# Altium project 掌控拓展板Ⅰ.PrjPcb
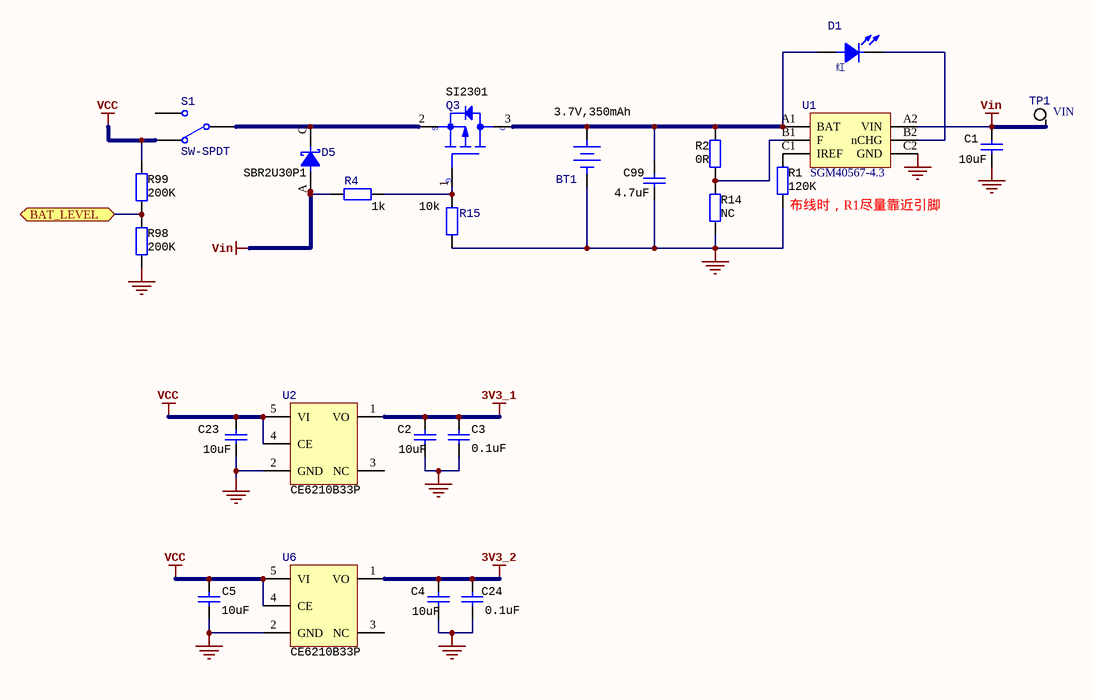
[diagram p0: 1.power.SchDoc]
4 sheets, 124 parts. Net scope: flat (ports and power ports of the same name join across sheets).
Board file: 掌控拓展板Ⅰ V2.1.PcbDoc
Sheets:
  1.power.SchDoc
  2.interface.SchDoc
  3 amplifier.SchDoc
  4.motor.SchDoc

## Sheet 1.power.SchDoc: 接口及电源
size A4; DrawnBy: 蒋朝晖; Organization: Seneasy; DocumentNumber: 项目编号; Revision: V2.1; SheetNumber: 1; SheetTotal: 2; Time: 2020-12-2

### Parts
BT1  3.7V,350mAh  [2P/1.0MM立式贴片座子]
C1  10uF  [C0603]
C2  10uF  [0603]
C3  0.1uF  [0402]
C4  10uF  [0603]
C5  10uF  [0603]
C23  10uF  [0603]
C24  0.1uF  [0402]
C99  4.7uF  [C0603]
D1  红  [0603LED]
D5  SBR2U30P1  [POWERDI123]
Q3  SI2301  [SOT23-3]
R1  120K  [R0402]
R2  0R  [R0402]
R4  1k  [R0402]
R14  NC  [R0402]
R15  10k  [R0402]
R98  200K  [R0402]
R99  200K  [R0402]
S1  SW-SPDT  [SW2]
TP1  VIN  [测试点]
U1  SGM40567-4.3  [SGM40567]
U2  CE6210B33P  [SOT89-5]
U6  CE6210B33P  [SOT89-5]

### Ports
BAT_LEVEL (bidir)

### Nets
3V3_1: C2.1 C3.2 U2.1(VO)
3V3_2: C4.1 C24.2 U6.1(VO)
NetBT1_2: BT1.2(-) C1.2 C2.2 C3.1 C4.2 C5.2 C23.2 C24.1 C99.2 R1.1 R14.2 R15.1 R98.1 U1.C2(GND) U2.2(GND) U6.2(GND)
VCC: C5.1 C23.1 R99.2 S1.3 U2.4(CE) U2.5(VI) U6.4(CE) U6.5(VI)
Vin: C1.1 D5.A(ANODE) R4.2 TP1.1 U1.A2(VIN)
NetBT1_1: BT1.1(+) C99.1 D1.A(ANODE) Q3.3(DRAIN) R2.1 U1.A1(BAT)
NetD1_C: D1.C(CATHODE) U1.B2(nCHG)
NetD5_C: D5.C(CATHODE) Q3.2(SOURCE) S1.2
NetQ3_1: Q3.1(GATE) R4.1 R15.2
NetR1_2: R1.2 U1.C1(IREF)
NetR2_2: R2.2 R14.1 U1.B1(F)
NetR98_2: R98.2 R99.1 ; port BAT_LEVEL

Not connected (* = marked no-connect by the designer): S1 1; U2 3(NC); U6 3(NC)

### Notes on the sheet
- (near R1) 布线时，R1尽量靠近引脚
- 标题:
- Size:
- A4
- 编号:
- 版本:
- 创建:
- 日期:
- Sheet
- of
- 审核:
- (in symbol PMOS) S; D; G

### Library data of the parts
BT1 = Battery: 4.2V Li-lon; Manufacturer: ?; PackageReference: ?; Value: ?; PartNumber: ?; ComponentLink1URL: ?
C1-C5 C23 C24 C99 = CAP1_npol: CAP, CERM, 0.01uF, 100V, +/-5%, X7R, 0603; PartNumber: 06031C103JAT2A; Manufacturer: AVX; Polarized: N; Tolerance: 5; ESR_Ohm: 0.098; Voltage Rating DC: 25V; RoHS Compliant: Y; MountType: SMT; Dielectric: X7R; ComponentLink1URL: http://www.avx.com/docs/masterpubs/smccp.pdf; Operating Temperature: -55+125C; PackageReference: 0603
  C1 C2 C4 C5 C23: Value: 10uF
  C3 C24: Value: 0.1uF
  C99: Value: 4.7uF
D1 = LED1: Manufacturer: ?; PackageReference: ?; PartNumber: ?; Value: ?
D5 = Diode_Schottky: Published: 8-Jun-2000; LatestRevisionDate: 17-Jul-2002; LatestRevisionNote: Re-released for DXP Platform.; PackageReference: SMB; Publisher: Altium Limited; PackageDescription: DO-214-AA/SMB; 2 C-Bend Leads; Body 5.3 x 3.6 mm, inc. leads (LxW); Code_JEDEC: DO-214-AA; Value: ?; PartNumber: ?; Manufacturer: ?
Q3 = PMOS: Manufacturer: ?; PackageReference: ?; PartNumber: ?; Value: ?
R1 R2 R98 R99 = RES1: RES, 1.0k ohm, 5%, 0.1W, 0603; PartNumber: RC0603JR-071KL; Manufacturer: Yageo America; CompType: Resistor; Res_ohm: 1000; Value_Code: 1k00; Tolerance_%: 5; Power_W: 0.1; VDC_V: 50; TempCo: 100 ppm/C; EIA_Code: E24; U/M: EA; SymbolVersion: 2009-05-29; RoHS: Y; Value1: 5%; Value2: 0.1W; MountType: SMT; Technology: Thick Film; Published: 2008-06-26; Publisher: Texas Instruments; LatestRevisionDate: 2014-04-18; ComponentLink1Description: Datasheet link; ComponentLink1URL: http://www.yageo.com/pdf/Pu-RC0603_51_PbFree_L_2.pdf; Supplier Part Number 1: 311-1.0KGRCT-ND; Supplier 2: Mouser; Supplier Part Number 2: 603-RC0603JR-071KL; Supplier 3: Farnell; Supplier Part Number 3: 9233385; PackageReference: 0603
  R1: Value: 120K
  R2: Value: 0R
  R98 R99: Value: 200K
R4 = Res2: Resistor; Published: 8-Jun-2000; LatestRevisionDate: 17-Jul-2002; LatestRevisionNote: Re-released for DXP Platform.; PackageReference: AXIAL-0.4; Publisher: Altium Limited; PackageDescription: Axial Device, Thru-Hole; 2 Leads; 0.4 in Pin Spacing; Value: 1K
R14 = RES1: RES, 1.0k ohm, 5%, 0.1W, 0603; PartNumber: RC0603JR-071KL; Manufacturer: Yageo America; CompType: Resistor; Res_ohm: 1000; Value_Code: 1k00; Tolerance_%: 5; Power_W: 0.1; VDC_V: 50; TempCo: 100 ppm/C; EIA_Code: E24; U/M: EA; Value: 0R; SymbolVersion: 2009-05-29; RoHS: Y; Value1: 5%; Value2: 0.1W; MountType: SMT; Technology: Thick Film; Published: 2008-06-26; Publisher: Texas Instruments; LatestRevisionDate: 2014-04-18; ComponentLink1Description: Datasheet link; ComponentLink1URL: http://www.yageo.com/pdf/Pu-RC0603_51_PbFree_L_2.pdf; Supplier Part Number 1: 311-1.0KGRCT-ND; Supplier 2: Mouser; Supplier Part Number 2: 603-RC0603JR-071KL; Supplier 3: Farnell; Supplier Part Number 3: 9233385; PackageReference: 0603
R15 = Res2: Resistor; Value: 1K; Published: 8-Jun-2000; LatestRevisionDate: 17-Jul-2002; LatestRevisionNote: Re-released for DXP Platform.; PackageReference: AXIAL-0.4; Publisher: Altium Limited; PackageDescription: Axial Device, Thru-Hole; 2 Leads; 0.4 in Pin Spacing
S1 = SW-SPDT: SPDT Subminiature Toggle Switch, Right Angle Mounting, Vertical Actuation; Published: 24-Mar-1999; LatestRevisionDate: 17-Dec-2003; LatestRevisionNote: Schematic revised, PCB Footprint replaced.; DatasheetVersion: 05-Dec-2000; PackageReference: TL36WW15050; Publisher: Altium Limited; PackageDescription: Switch; 4 Leads; ComponentLink1Description: Manufacturer Link; ComponentLink1URL: http://www.apem.com; 采购网址: http://www.cnhsdz.com/huansheng/products_content-437702.html
TP1 = TP: Test Point
U1 = SGM40567: 充电IC
U2 U6 = AP2112K

## Sheet 2.interface.SchDoc: 接口
size A4; DrawnBy: 蒋朝晖; Organization: Seneasy; DocumentNumber: 项目编号; Revision: V2.1; SheetNumber: 1; SheetTotal: 2; PageSetup: Record=PageOptions|CenterHorizontal=True|CenterVertical=True|PrintScale=0.98|XCorrection=1.00|YCorrection=1.00|PrintKind=1|BorderSize=5000000|LeftOffset=0|BottomOffset=0|Orientation=2|PaperLength=2970|PaperWidth=2100|Scale=100|PaperSource=261|PrintQuality=-3|MediaType=1|DitherType=10|PrintScaleMode=1|PaperKind=A4 210 x 297 毫米¦PaperIndex=9; Time: 2020-12-2
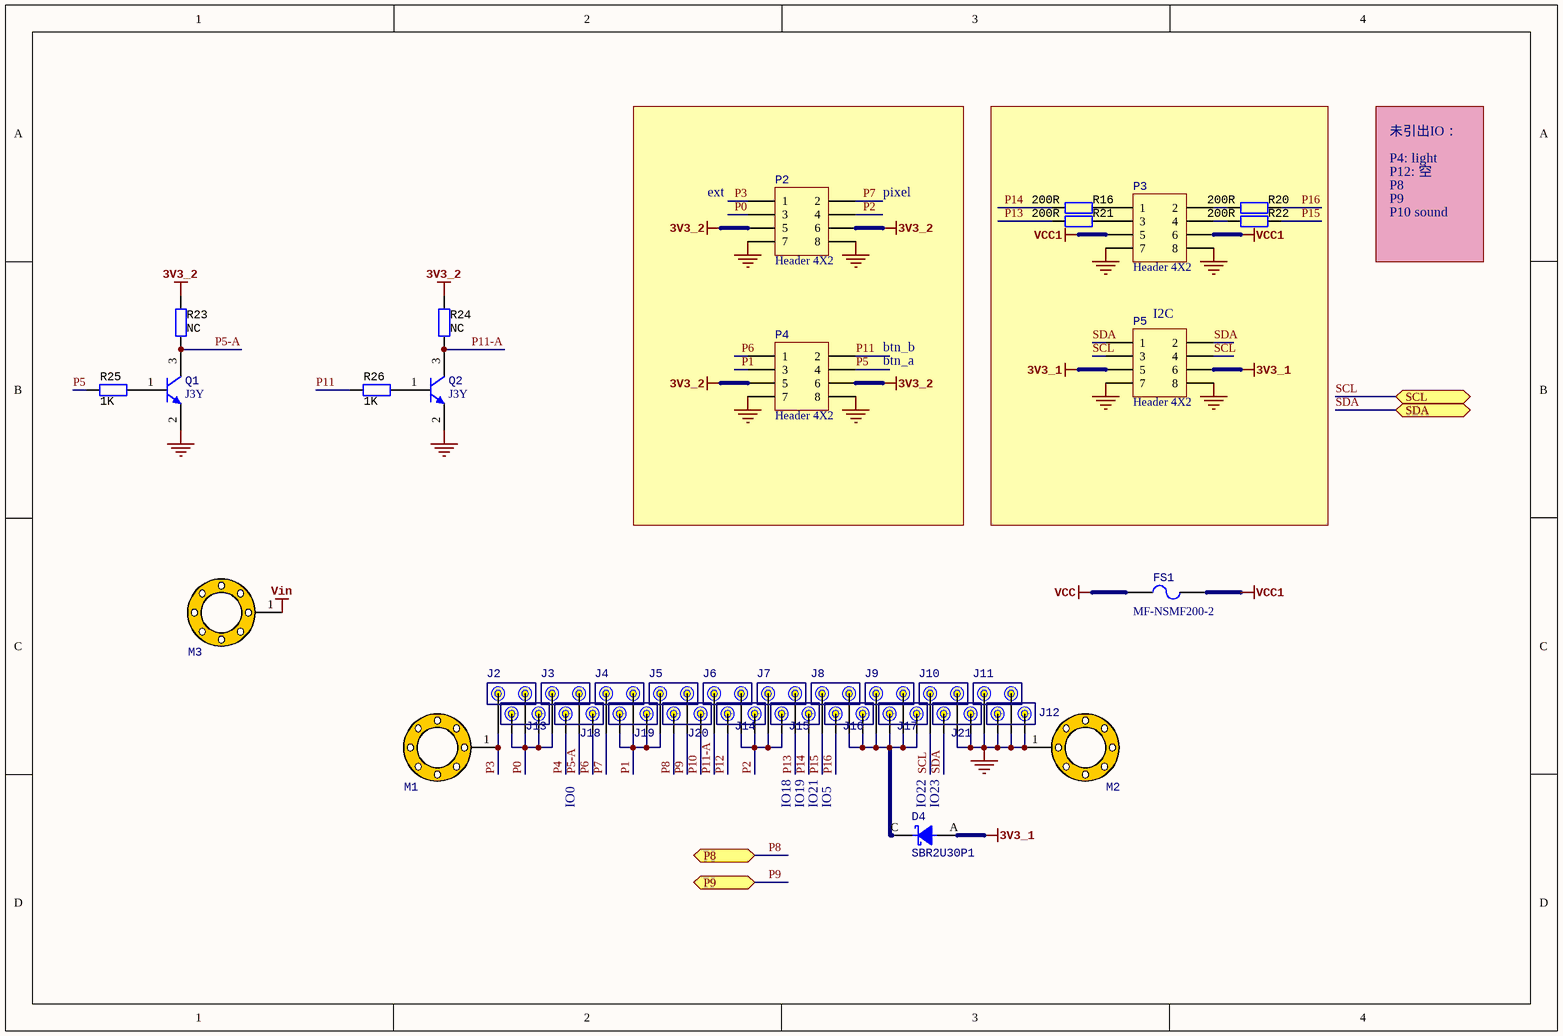
[diagram p1: 2.interface.SchDoc]

### Parts
D4  SBR2U30P1  [POWERDI123]
FS1  MF-NSMF200-2  [R1206]
J2  (no value)  [顶针座子（2.54MM）]
J3  (no value)  [顶针座子（2.54MM）]
J4  (no value)  [顶针座子（2.54MM）]
J5  (no value)  [顶针座子（2.54MM）]
J6  (no value)  [顶针座子（2.54MM）]
J7  (no value)  [顶针座子（2.54MM）]
J8  (no value)  [顶针座子（2.54MM）]
J9  (no value)  [顶针座子（2.54MM）]
J10  (no value)  [顶针座子（2.54MM）]
J11  (no value)  [顶针座子（2.54MM）]
J12  (no value)  [顶针座子（2.54MM）]
J13  (no value)  [顶针座子（2.54MM）]
J14  (no value)  [顶针座子（2.54MM）]
J15  (no value)  [顶针座子（2.54MM）]
J16  (no value)  [顶针座子（2.54MM）]
J17  (no value)  [顶针座子（2.54MM）]
J18  (no value)  [顶针座子（2.54MM）]
J19  (no value)  [顶针座子（2.54MM）]
J20  (no value)  [顶针座子（2.54MM）]
J21  (no value)  [顶针座子（2.54MM）]
M1  (no value)  [3MM螺丝孔]
M2  (no value)  [3MM螺丝孔]
M3  (no value)  [3MM螺丝孔]
P2  Header 4X2  [双拼弯角排针2.54/4P]
P3  Header 4X2  [双拼弯角排针2.54/4P]
P4  Header 4X2  [双拼弯角排针2.54/4P]
P5  Header 4X2  [双拼弯角排针2.54/4P]
Q1  J3Y  [DFN 3L]
Q2  J3Y  [DFN 3L]
R16  200R  [0402]
R20  200R  [0402]
R21  200R  [0402]
R22  200R  [0402]
R23  NC  [0402]
R24  NC  [0402]
R25  1K  [0402]
R26  1K  [0402]

### Blocks framed on the sheet
I2C: P3 P5 R16 R20-R22

### Ports
P8 (bidir), P9 (bidir), SCL (bidir), SDA (bidir)

### Nets
3V3_1: D4.A(ANODE) P5.5 P5.6
3V3_2: P2.5 P2.6 P4.5 P4.6 R23.1 R24.1
NetBT1_2: J10.2 J11.1 J11.2 J12.1 J12.2 J21.2 M2.1 P2.7 P2.8 P3.7 P3.8 P4.7 P4.8 P5.7 P5.8 Q1.2(E) Q2.2(E)
VCC: FS1.2
VCC1: FS1.1 P3.5 P3.6
Vin: M3.1
P0: J2.2 J3.1 J13.1 J13.2 P2.3
P1: J4.2 J5.1 J19.1 J19.2 P4.3
P2: J6.2 J7.1 J14.2 J15.1 P2.4
P3: J2.1 M1.1 P2.1
P4: J18.1
P5: P4.4 R25.1
P5-A: J3.2 Q1.3(C) R23.2
P6: J18.2 P4.1
P7: J4.1 P2.2
P8: J20.1 ; port P8
P9: J5.2 ; port P9
P10: J20.2
P11: P4.2 R26.1
P11-A: J6.1 Q2.3(C) R24.2
P12: J14.1
P13: J7.2 R21.1
P14: J15.2 R16.1
P15: J8.1 R22.2
P16: J16.1 R20.2
SCL: J10.1 P5.3 P5.4 ; port SCL
SDA: J21.1 P5.1 P5.2 ; port SDA
NetD4_C: D4.C(CATHODE) J8.2 J9.1 J9.2 J16.2 J17.1 J17.2
NetP3_1: P3.1 R16.2
NetP3_2: P3.2 R20.1
NetP3_3: P3.3 R21.2
NetP3_4: P3.4 R22.1
NetQ1_1: Q1.1(B) R25.2
NetQ2_1: Q2.1(B) R26.2

### Notes on the sheet
- 未引出IO：
- P4: light
- P12: 空
- (near P2) ext
- pixel
- P8
- P9
- P10 sound
- btn_a
- btn_b
- IO0
- IO18
- IO19
- IO21
- IO5
- (near D4) IO22
- (near D4) IO23
- Title
- Size:
- Date:
- A4
- Number:
- Time:
- Revision:
- Sheet
- of
- File:

### Library data of the parts
D4 = Diode_Schottky: Published: 8-Jun-2000; LatestRevisionDate: 17-Jul-2002; LatestRevisionNote: Re-released for DXP Platform.; PackageReference: SMB; Publisher: Altium Limited; PackageDescription: DO-214-AA/SMB; 2 C-Bend Leads; Body 5.3 x 3.6 mm, inc. leads (LxW); Code_JEDEC: DO-214-AA; Value: ?; PartNumber: ?; Manufacturer: ?
FS1 = 电子保险丝: 保险管
J2-J11 = pogopin
J12-J21 = pogopin_32
M1-M3 = screw
P2-P5 = Header 4X2: Header, 4-Pin, Dual row; LatestRevisionDate: 17-Jul-2002; LatestRevisionNote: Re-released for DXP Platform.; Publisher: Altium Limited
Q1 Q2 = 2N3904: NPN General Purpose Amplifier; Published: 8-Jun-2000; LatestRevisionDate: 15-Jan-2003; LatestRevisionNote: PCB Footprint 'BCY-W3/D4.7' replaced; DatasheetVersion: 1997; PackageVersion: Sep-1998; PackageReference: TO-92A; Publisher: Altium Limited; PackageDescription: TO, Flat Index; 3 In-Line, Axial Leads; Body Dia. 4.5mm; Leads 0.51 x 0.48 mm (max); ComponentLink1Description: Manufacturer Link; ComponentLink1URL: http://www.fairchildsemi.com/; ComponentLink2Description: Datasheet; ComponentLink2URL: http://www.fairchildsemi.com/ds/2N%2F2N3904.pdf
R16 R20-R22 R25 R26 = RES1: as R1 on sheet 1.power; SymbolVersion: 2009-05-29; RoHS: Y; Value1: 5%; Value2: 0.1W; MountType: SMT; Technology: Thick Film; Published: 2008-06-26; Publisher: Texas Instruments; LatestRevisionDate: 2014-04-18; ComponentLink1Description: Datasheet link; ComponentLink1URL: http://www.yageo.com/pdf/Pu-RC0603_51_PbFree_L_2.pdf; Supplier Part Number 1: 311-1.0KGRCT-ND; Supplier 2: Mouser; Supplier Part Number 2: 603-RC0603JR-071KL; Supplier 3: Farnell; Supplier Part Number 3: 9233385; PackageReference: 0603
  R16 R20-R22: Value: 200R
  R25 R26: Value: 1K
R23 R24 = RES1: RES, 1.0k ohm, 5%, 0.1W, 0603; PartNumber: RC0603JR-071KL; Manufacturer: Yageo America; CompType: Resistor; Res_ohm: 1000; Value_Code: 1k00; Tolerance_%: 5; Power_W: 0.1; VDC_V: 50; TempCo: 100 ppm/C; EIA_Code: E24; U/M: EA; Value: 10K; SymbolVersion: 2009-05-29; RoHS: Y; Value1: 5%; Value2: 0.1W; MountType: SMT; Technology: Thick Film; Published: 2008-06-26; Publisher: Texas Instruments; LatestRevisionDate: 2014-04-18; ComponentLink1Description: Datasheet link; ComponentLink1URL: http://www.yageo.com/pdf/Pu-RC0603_51_PbFree_L_2.pdf; Supplier Part Number 1: 311-1.0KGRCT-ND; Supplier 2: Mouser; Supplier Part Number 2: 603-RC0603JR-071KL; Supplier 3: Farnell; Supplier Part Number 3: 9233385; PackageReference: 0603

## Sheet 3 amplifier.SchDoc: 音频功放
size A4; DrawnBy: 蒋朝晖; Revision: V2.1; PageSetup: Record=PageOptions|CenterHorizontal=True|CenterVertical=True|PrintScale=0.98|XCorrection=1.00|YCorrection=1.00|PrintKind=1|BorderSize=5000000|LeftOffset=0|BottomOffset=0|Orientation=2|PaperLength=2970|PaperWidth=2100|Scale=100|PaperSource=261|PrintQuality=-3|MediaType=1|DitherType=10|PrintScaleMode=1|PaperKind=A4 210 x 297 毫米¦PaperIndex=9; Time: 2020-12-2
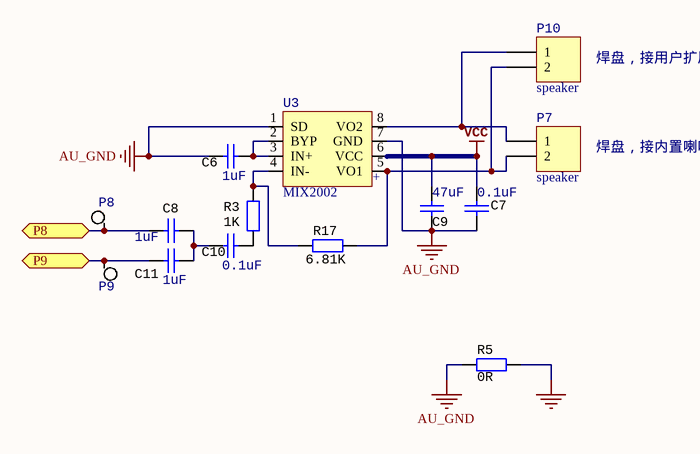
[diagram p2: 3 amplifier.SchDoc]

### Parts
C6  1uF  [0402]
C7  0.1uF  [0402]
C8  1uF  [0402]
C9  47uF  [0805]
C10  0.1uF  [0402]
C11  1uF  [0402]
P7  speaker  [焊盘]
P8  (no value)  [测试点]
P9  (no value)  [测试点]
P10  speaker  [2PIN/2.0MM座子]
R3  1K  [0402]
R5  0R  [0402]
R17  6.81K  [0402]
U3  MIX2002  [SOP-8]

### Ports
P8 (bidir), P9 (bidir)

### Nets
AU_GND: C6.1 C7.2 C9.2 R5.2 U3.1(SD) U3.7(GND)
NetBT1_2: R5.1
VCC: C7.1 C9.1 U3.6(VCC)
P8: C8.2 P8.1 ; port P8
P9: C11.2 P9.1 ; port P9
NetC6_2: C6.2 U3.2(BYP) U3.3(IN+)
NetC8_1: C8.1 C10.1 C11.1
NetC10_2: C10.2 R3.1
NetP7_1: P7.1 P10.1 U3.8(VO2)
NetP7_2: P7.2 P10.2 R17.2 U3.5(VO1)
NetR3_2: R3.2 R17.1 U3.4(IN-)

### Notes on the sheet
- 焊盘，接用户扩展喇叭
- (near U3) +
- 焊盘，接内置喇叭

### Library data of the parts
C6-C11 = CAP1_npol: as C1 on sheet 1.power; RoHS Compliant: Y; MountType: SMT; Dielectric: X7R; ComponentLink1URL: http://www.avx.com/docs/masterpubs/smccp.pdf; Operating Temperature: -55+125C; PackageReference: 0603
  C6 C8 C11: Value: 1uF
  C7 C10: Value: 0.1uF
  C9: Value: 47uF
P7 P10 = Header 2: Header, 2-Pin; LatestRevisionDate: 17-Jul-2002; LatestRevisionNote: Re-released for DXP Platform.; Publisher: Altium Limited; 封装链接: https://item.taobao.com/item.htm?spm=a230r.1.14.27.3Tbh4z&id=540251210643&ns=1&abbucket=11#detail
P8 P9 = TP: Test Point
R3 R5 R17 = RES1: as R1 on sheet 1.power; SymbolVersion: 2009-05-29; RoHS: Y; Value1: 5%; Value2: 0.1W; MountType: SMT; Technology: Thick Film; Published: 2008-06-26; Publisher: Texas Instruments; LatestRevisionDate: 2014-04-18; ComponentLink1Description: Datasheet link; ComponentLink1URL: http://www.yageo.com/pdf/Pu-RC0603_51_PbFree_L_2.pdf; Supplier Part Number 1: 311-1.0KGRCT-ND; Supplier 2: Mouser; Supplier Part Number 2: 603-RC0603JR-071KL; Supplier 3: Farnell; Supplier Part Number 3: 9233385; PackageReference: 0603
  R3: Value: 1K
  R5: Value: 0R
  R17: Value: 6.81K
U3 = MIX2002: 名称: MIX2002

## Sheet 4.motor.SchDoc: 电机控制
size A4; DrawnBy: 蒋朝晖; Organization: Seneasy; DocumentNumber: 项目编号; Revision: 版本号; SheetNumber: 1; SheetTotal: 2; Time: 2018-10-20
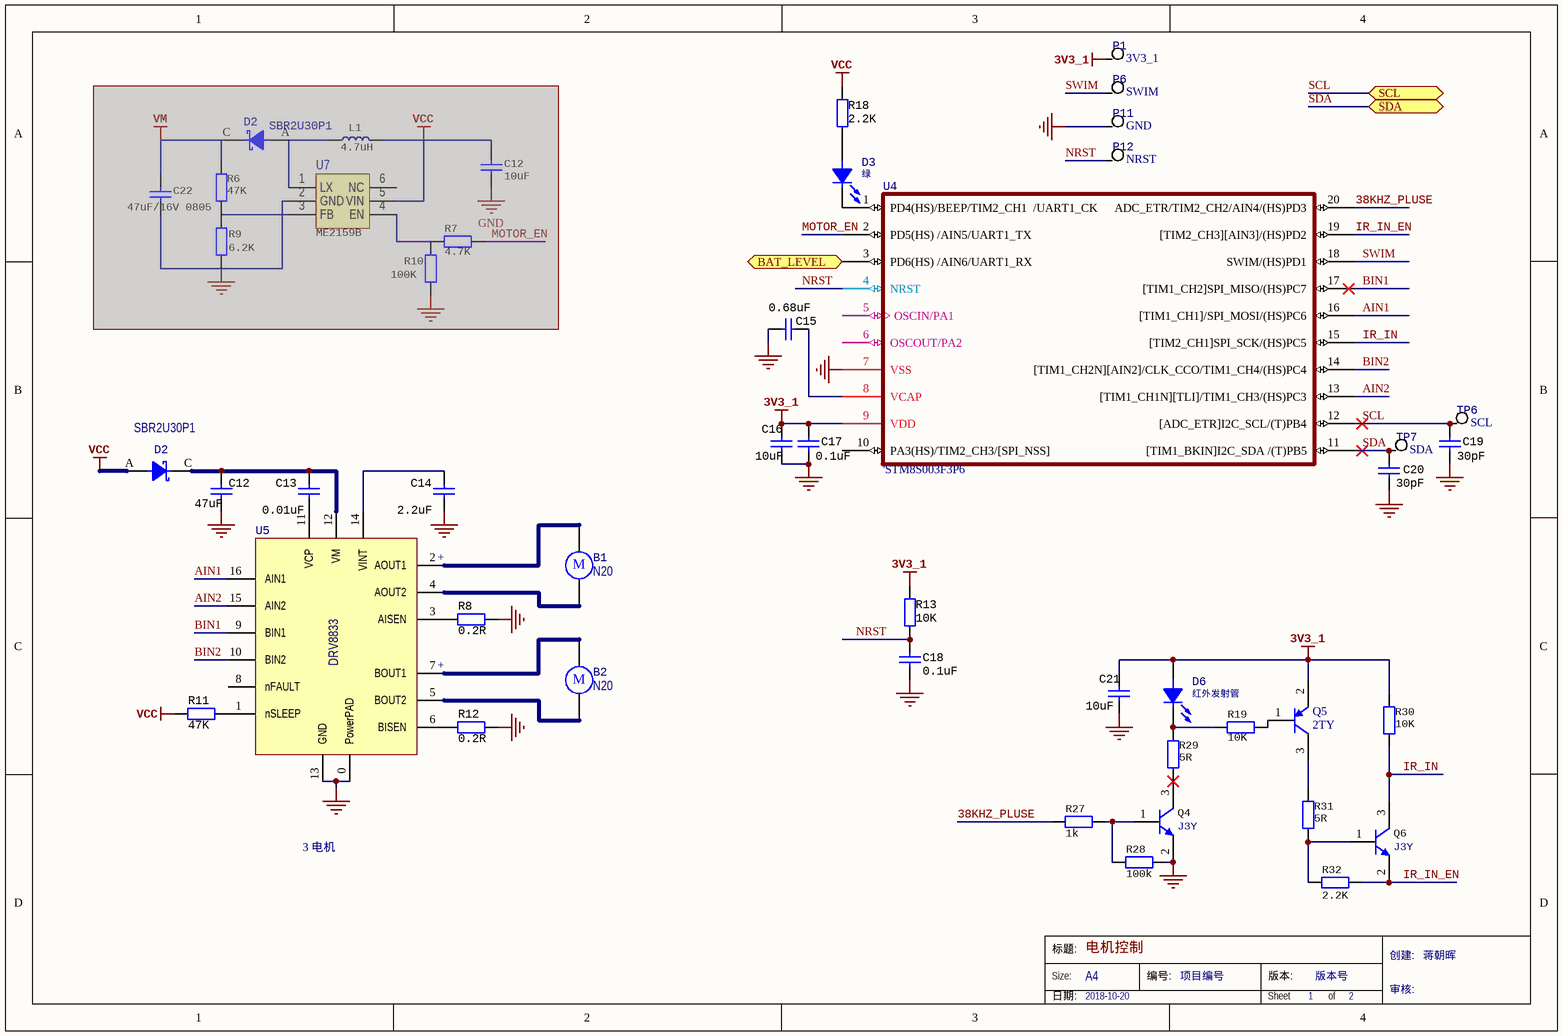
[diagram p3: 4.motor.SchDoc]

### Parts
(Parts that share a designator on the sheet are numbered #1, #2 ... from top to bottom, then left to right.)
B1  N20  [2PIN/2.54MM座子]
B2  N20  [2PIN/2.54MM座子]
C12#1  10uF  [C0603]  (masked out: inside a compile mask, not in the netlist)
C12#2  47uF  [0805]
C13  0.01uF  [0402]
C14  2.2uF  [0402]
C15  0.68uF  [0402]
C16  10uF  [0603]
C17  0.1uF  [0402]
C18  0.1uF  [0402]
C19  30pF  [0402]
C20  30pF  [0402]
C21  10uF  [C0603]
C22  47uF/16V 0805  [C0805]  (masked out: inside a compile mask, not in the netlist)
D2#1  SBR2U30P1  [POWERDI123]  (masked out: inside a compile mask, not in the netlist)
D2#2  SBR2U30P1  [POWERDI123]
D3  绿  [0603LED]
D6  红外发射管  [贴片发射管]
L1  4.7uH  [INDM8070X500N]  (masked out: inside a compile mask, not in the netlist)
P1  3V3_1  [测试点]
P6  SWIM  [测试点]
P11  GND  [测试点]
P12  NRST  [测试点]
Q4  J3Y  [DFN 3L]
Q5  2TY  [DFN 3L]
Q6  J3Y  [DFN 3L]
R6  47K  [R0603]  (masked out: inside a compile mask, not in the netlist)
R7  4.7K  [R0603]  (masked out: inside a compile mask, not in the netlist)
R8  0.2R  [R0603]
R9  6.2K  [R0603]  (masked out: inside a compile mask, not in the netlist)
R10  100K  [R0603]  (masked out: inside a compile mask, not in the netlist)
R11  47K  [0402]
R12  0.2R  [R0603]
R13  10K  [0402]
R18  2.2K  [0402]
R19  10K  [R0402]
R27  1k  [R0402]
R28  100k  [R0402]
R29  5R  [R0603]
R30  10K  [R0402]
R31  5R  [R0603]
R32  2.2K  [R0402]
TP6  SCL  [测试点]
TP7  SDA  [测试点]
U4  'STM8S003F3P6  [UFQFPN20]
U5  DRV8833  [HTSSOP -16(PWP)]
U7  ME2159B  [SOT23-6]  (masked out: inside a compile mask, not in the netlist)

### Ports
BAT_LEVEL (bidir), SCL (bidir), SDA (bidir)

### Nets
3V3_1: C16.1 C17.2 C21.1 D6.A(ANODE) P1.1 Q5.2(E) R13.1 R30.1 U4.9(VDD)
GND: C12#2.2
NetBT1_2: C14.1 C15.2 C16.2 C17.1 C18.1 C19.1 C20.1 C21.2 P11.1 Q4.2(E) R8.2 R12.2 R28.2 U4.7(VSS) U5.0(PowerPAD) U5.13(GND)
VCC: D2#2.A(ANODE) R11.1 R18.1
38KHZ_PLUSE: R27.1 U4.20(ADC_ETR/TIM2_CH2/AIN4/(HS)PD3)
AIN1: U4.16([TIM1_CH1]/SPI_MOSI/(HS)PC6) U5.16(AIN1)
AIN2: U4.13([TIM1_CH1N][TLI]/TIM1_CH3/(HS)PC3) U5.15(AIN2)
BIN1: U4.17([TIM1_CH2]SPI_MISO/(HS)PC7) U5.9(BIN1)
BIN2: U4.14([TIM1_CH2N][AIN2]/CLK_CCO/TIM1_CH4/(HS)PC4) U5.10(BIN2)
IR_IN: Q6.3(C) R30.2 U4.15([TIM2_CH1]SPI_SCK/(HS)PC5)
IR_IN_EN: Q6.2(E) R32.2 U4.19([TIM2_CH3][AIN3]/(HS)PD2)
MOTOR_EN: U4.2(PD5(HS)_/AIN5/UART1_TX)
NRST: C18.2 P12.1 R13.2 U4.4(NRST)
SCL: C19.2 TP6.1 U4.12([ADC_ETR]I2C_SCL/(T)PB4) ; port SCL
SDA: C20.2 TP7.1 U4.11([TIM1_BKIN]I2C_SDA_/(T)PB5) ; port SDA
SWIM: P6.1 U4.18(SWIM/(HS)PD1)
NetB1_1: B1.1 U5.2(AOUT1)
NetB1_2: B1.2 U5.4(AOUT2)
NetB2_1: B2.1 U5.7(BOUT1)
NetB2_2: B2.2 U5.5(BOUT2)
NetC12#2_1: C12#2.1 C13.2 D2#2.C(CATHODE) U5.12(VM)
NetC13_1: C13.1 U5.11(VCP)
NetC14_2: C14.2 U5.14(VINT)
NetC15_1: C15.1 U4.8(VCAP)
NetD3_A: D3.A(ANODE) R18.2
NetD3_C: D3.C(CATHODE) U4.1(PD4(HS)/BEEP/TIM2_CH1__/UART1_CK)
NetD6_C: D6.C(CATHODE) R19.2 R29.2
NetQ4_1: Q4.1(B) R27.2 R28.1
NetQ4_3: Q4.3(C) R29.1
NetQ5_1: Q5.1(B) R19.1
NetQ5_3: Q5.3(C) R31.1
NetQ6_1: Q6.1(B) R31.2 R32.1
NetR8_1: R8.1 U5.3(AISEN)
NetR11_2: R11.2 U5.1(nSLEEP)
NetR12_1: R12.1 U5.6(BISEN)
NetR98_2: U4.3(PD6(HS)_/AIN6/UART1_RX) ; port BAT_LEVEL

Not connected (* = marked no-connect by the designer): U4 5(OSCIN/PA1) 6(OSCOUT/PA2) 10(PA3(HS)/TIM2_CH3/[SPI_NSS]); U5 8(nFAULT)

### Notes on the sheet
- (near U5) +
- 3 电机
- 标题:
- Size:
- A4
- 编号:
- 版本:
- 创建:
- 日期:
- Sheet
- of
- 审核:
- (in symbol Motor) M

### Library data of the parts
B1 B2 = Motor: Motor, General Kind; Published: 24-Mar-1999; LatestRevisionDate: 17-Jul-2002; LatestRevisionNote: Re-released for DXP Platform.; PackageReference: RB5-10.5; Publisher: Altium Limited; PackageDescription: Capacitor (Radial); 2 Leads
C12#1 = CAP1_npol: CAP, CERM, 0.01uF, 100V, +/-5%, X7R, 0603; PartNumber: 06031C103JAT2A; Manufacturer: AVX; Polarized: N; Tolerance: 5; ESR_Ohm: 0.098; Voltage Rating DC: 16V; Value: 10uF; RoHS Compliant: Y; MountType: SMT; Dielectric: X7R; ComponentLink1URL: http://www.avx.com/docs/masterpubs/smccp.pdf; PackageReference: 0603; Operating Temperature: -55+125C
C12#2 C13-C21 = CAP1_npol: as C1 on sheet 1.power; RoHS Compliant: Y; MountType: SMT; Dielectric: X7R; ComponentLink1URL: http://www.avx.com/docs/masterpubs/smccp.pdf; Operating Temperature: -55+125C; PackageReference: 0603
  C12#2: Value: 47uF
  C13: Value: 0.01uF
  C14: Value: 2.2uF
  C15: Value: 0.68uF
  C16 C21: Value: 10uF
  C17 C18: Value: 0.1uF
  C19 C20: Value: 30pF
C22 = CAP1_npol: CAP, CERM, 0.01uF, 100V, +/-5%, X7R, 0603; PartNumber: 06031C103JAT2A; Manufacturer: AVX; Polarized: N; Value: 10uF; Tolerance: 5; ESR_Ohm: 0.098; Voltage Rating DC: 25V; RoHS Compliant: Y; MountType: SMT; Dielectric: X7R; ComponentLink1URL: http://www.avx.com/docs/masterpubs/smccp.pdf; Operating Temperature: -55+125C; PackageReference: 0603
D2#1 D2#2 = Diode_Schottky: Published: 8-Jun-2000; LatestRevisionDate: 17-Jul-2002; LatestRevisionNote: Re-released for DXP Platform.; PackageReference: SMB; Publisher: Altium Limited; PackageDescription: DO-214-AA/SMB; 2 C-Bend Leads; Body 5.3 x 3.6 mm, inc. leads (LxW); Code_JEDEC: DO-214-AA; Value: ?; PartNumber: ?; Manufacturer: ?
D3 D6 = LED1: Manufacturer: ?; PackageReference: ?; PartNumber: ?; Value: ?
L1 = INDUCTOR
P1 P6 P11 P12 TP6 TP7 = TP: Test Point
Q4 Q6 = 2N3904: NPN General Purpose Amplifier; Published: 8-Jun-2000; LatestRevisionDate: 15-Jan-2003; LatestRevisionNote: PCB Footprint 'BCY-W3/D4.7' replaced; DatasheetVersion: 1997; PackageVersion: Sep-1998; PackageReference: TO-92A; Publisher: Altium Limited; PackageDescription: TO, Flat Index; 3 In-Line, Axial Leads; Body Dia. 4.5mm; Leads 0.51 x 0.48 mm (max); ComponentLink1Description: Manufacturer Link; ComponentLink1URL: http://www.fairchildsemi.com/; ComponentLink2Description: Datasheet; ComponentLink2URL: http://www.fairchildsemi.com/ds/2N%2F2N3904.pdf
Q5 = S8550: PNP Transistor
R6 = RES1: RES, 1.0k ohm, 5%, 0.1W, 0603; PartNumber: RC0603JR-071KL; Manufacturer: Yageo America; CompType: Resistor; Res_ohm: 1000; Value_Code: 1k00; Tolerance_%: 5; Power_W: 0.1; VDC_V: 50; TempCo: 100 ppm/C; EIA_Code: E24; U/M: EA; Value: 100K; SymbolVersion: 2009-05-29; RoHS: Y; Value1: 5%; Value2: 0.1W; MountType: SMT; Technology: Thick Film; Published: 2008-06-26; Publisher: Texas Instruments; LatestRevisionDate: 2014-04-18; ComponentLink1Description: Datasheet link; ComponentLink1URL: http://www.yageo.com/pdf/Pu-RC0603_51_PbFree_L_2.pdf; Supplier Part Number 1: 311-1.0KGRCT-ND; Supplier 2: Mouser; Supplier Part Number 2: 603-RC0603JR-071KL; Supplier 3: Farnell; Supplier Part Number 3: 9233385; PackageReference: 0603
R7 R9 R10 = RES1: RES, 1.0k ohm, 5%, 0.1W, 0603; PartNumber: RC0603JR-071KL; Manufacturer: Yageo America; CompType: Resistor; Res_ohm: 1000; Value_Code: 1k00; Tolerance_%: 5; Power_W: 0.1; VDC_V: 50; TempCo: 100 ppm/C; EIA_Code: E24; U/M: EA; Value: 13.3K; SymbolVersion: 2009-05-29; RoHS: Y; Value1: 5%; Value2: 0.1W; MountType: SMT; Technology: Thick Film; Published: 2008-06-26; Publisher: Texas Instruments; LatestRevisionDate: 2014-04-18; ComponentLink1Description: Datasheet link; ComponentLink1URL: http://www.yageo.com/pdf/Pu-RC0603_51_PbFree_L_2.pdf; Supplier Part Number 1: 311-1.0KGRCT-ND; Supplier 2: Mouser; Supplier Part Number 2: 603-RC0603JR-071KL; Supplier 3: Farnell; Supplier Part Number 3: 9233385; PackageReference: 0603
R8 R11-R13 R18 R19 R27-R32 = RES1: as R1 on sheet 1.power; SymbolVersion: 2009-05-29; RoHS: Y; Value1: 5%; Value2: 0.1W; MountType: SMT; Technology: Thick Film; Published: 2008-06-26; Publisher: Texas Instruments; LatestRevisionDate: 2014-04-18; ComponentLink1Description: Datasheet link; ComponentLink1URL: http://www.yageo.com/pdf/Pu-RC0603_51_PbFree_L_2.pdf; Supplier Part Number 1: 311-1.0KGRCT-ND; Supplier 2: Mouser; Supplier Part Number 2: 603-RC0603JR-071KL; Supplier 3: Farnell; Supplier Part Number 3: 9233385; PackageReference: 0603
  R8 R12: Value: 0.2R
  R11: Value: 47K
  R13 R19 R30: Value: 10K
  R18 R32: Value: 2.2K
  R27: Value: 1k
  R28: Value: 100k
  R29 R31: Value: 5R
U4 = STM8S103F2P6: ST 8-bit  Microcontroller
U5 = DRV8833PWP: DUAL H-BRIDGE MOTOR DRIVER
U7 = ME2159: DC DC升压IC

## Nets that join several sheets
3V3_1: 1.power (C2.1 C3.2 U2.1), 2.interface (D4.A P5.5 P5.6), 4.motor (9 pins)
3V3_2: 1.power (C4.1 C24.2 U6.1), 2.interface (6 pins)
NetBT1_2: 1.power (16 pins), 2.interface (17 pins), 3 amplifier (R5.1), 4.motor (16 pins)
VCC: 1.power (8 pins), 2.interface (FS1.2), 3 amplifier (C7.1 C9.1 U3.6), 4.motor (D2#2.A R11.1 R18.1)
Vin: 1.power (5 pins), 2.interface (M3.1)
NetR98_2: 1.power (R98.2 R99.1), 4.motor (U4.3)
P8: 2.interface (J20.1), 3 amplifier (C8.2 P8.1)
P9: 2.interface (J5.2), 3 amplifier (C11.2 P9.1)
SCL: 2.interface (J10.1 P5.3 P5.4), 4.motor (C19.2 TP6.1 U4.12)
SDA: 2.interface (J21.1 P5.1 P5.2), 4.motor (C20.2 TP7.1 U4.11)